# Altium schematic sheet acrostar_hv_boost.SchDoc: AcroIQ HV LED: Boost Controller
size A4; DocumentNumber: 2; Revision: C; SheetNumber: 2; SheetTotal: 4
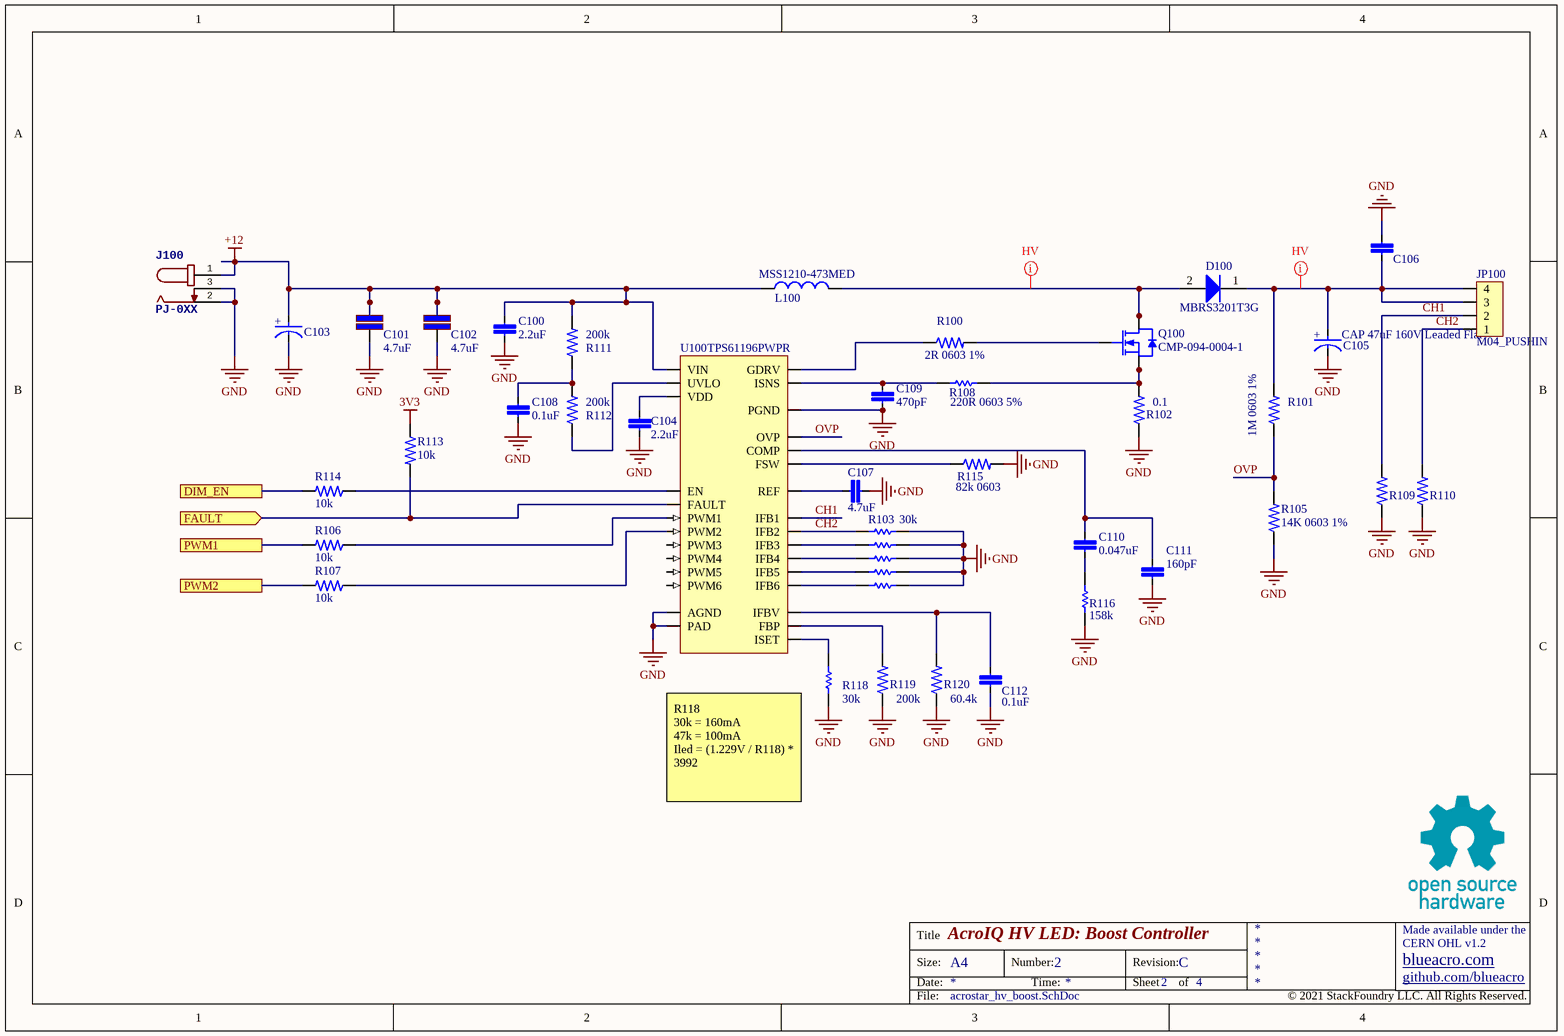
[diagram p0: acrostar_hv_boost.SchDoc]

## Parts
C100  2.2uF  [FP-CL10-IPC_B]
C101  4.7uF  [CAPC3225X20N]
C102  4.7uF  [CAPC3225X20N]
C103  CAP 100uF 25V POLY  [25SVF100M-Footprint-1]  (value not drawn)
C104  2.2uF  [FP-CL10-IPC_B]
C105  CAP 47uF 160V Leaded Flat  [CAP 47uF 160V Leaded Flat-Footprint-1]
C106  1uF 250V X7R 2220  [CAPC5750X23N]  (value not drawn)
C107  4.7uF  [FP-CL10-IPC_C]
C108  0.1uF  [FP-CL10-IPC_B]
C109  470pF  [FP-CL10-IPC_A]
C110  0.047uF  [FP-CL10-IPC_A]
C111  160pF  [FP-CL10-IPC_A]
C112  0.1uF  [FP-CL10-IPC_B]
D100  MBRS3201T3G  [ONSC-SMC-2-403-03_V]
J100  PJ-0XX  [PJ-036AH]
JP100  M04_PUSHIN  [PHOENIX_PTSM_4_1778780]
L100  MSS1210-473MED  [MSS1210-473MED-Footprint-1]
Q100  CMP-094-0004-1  [PG-TDSON-8]
R100  2R 0603 1%  [RESC1608-IPC-NL]
R101  1M 0603 1%  [RESC1608-IPC-NL]
R102  0.1  [RESC3016X07N]
R103  30k  [RESC1608-IPC-NL]
R104  30k  [RESC1608-IPC-NL]  (value not drawn)
R105  14K 0603 1%  [RESC1608-IPC-NL]
R106  10k  [RESC1608-IPC-NL]
R107  10k  [RESC1608-IPC-NL]
R108  220R 0603 5%  [RESC1608-IPC-NL]
R109  10M 0603  [RESC1608-IPC-NL]  (value not drawn)
R110  10M 0603  [RESC1608-IPC-NL]  (value not drawn)
R111  200k  [RESC1608-IPC-NL]
R112  200k  [RESC1608-IPC-NL]
R113  10k  [RESC1608-IPC-NL]
R114  10k  [RESC1608-IPC-NL]
R115  82k 0603  [RESC1608-IPC-LL]
R116  158k  [RESC1608-IPC-ML]
R118  30k  [RESC1608-IPC-NL]
R119  200k  [RESC1608-IPC-NL]
R120  60.4k  [RESC1608-IPC-NL]
R121  30k  [RESC1608-IPC-NL]  (value not drawn)
R122  30k  [RESC1608-IPC-NL]  (value not drawn)
R123  30k  [RESC1608-IPC-NL]  (value not drawn)
U100  TPS61196PWPR  [TSOP65P640X120_HS-29N]

## Ports
DIM_EN, FAULT (in), PWM1, PWM2

## Nets
3V3: R113.1
+12: C100.2 C101.2 C102.2 C103.2(A) J100.1 L100.1 R111.2 U100.28(VIN)
GND: C100.1 C101.1 C102.1 C103.1(C) C104.1 C105.1(C) C106.2 C107.2 C108.2 C109.2 C111.2 C112.2 J100.2 J100.3 R102.1 R103.1 R104.1 R105.1 R109.1 R110.1 R115.2 R116.1 R118.1 R119.1 R120.1 R121.1 R122.1 R123.1 U100.18(AGND) U100.22(PGND) U100.29(PAD)
CH1: JP100.2 R109.2 U100.12(IFB1)
CH2: JP100.1 R103.2 R110.2 U100.13(IFB2)
DIM_EN: R114.2 ; port DIM_EN
FAULT: R113.2 U100.27(FAULT) ; port FAULT
OVP: R101.1 R105.2 U100.19(OVP)
PWM1: R106.2 ; port PWM1
PWM2: R107.2 ; port PWM2
NetC104_2: C104.2 U100.25(VDD)
NetC105_2: C105.2(A) C106.1 D100.1(K) JP100.3 JP100.4 R101.2
NetC107_1: C107.1 U100.21(REF)
NetC108_1: C108.1 R111.1 R112.2
NetC109_1: C109.1 R108.1 U100.23(ISNS)
NetC110_1: C110.1 C111.1 U100.20(COMP)
NetC110_2: C110.2 R116.2
NetC112_1: C112.1 R120.2 U100.11(IFBV)
NetD100_2: D100.2(A) L100.2 Q100.5(D) Q100.6(D) Q100.7(D) Q100.8(D) Q100.PAD(D)
NetQ100_1: Q100.1(S) Q100.2(S) Q100.3(S) R102.2 R108.2
NetQ100_4: Q100.4(G) R100.2
NetR100_1: R100.1 U100.24(GDRV)
NetR104_2: R104.2 U100.14(IFB3)
NetR106_1: R106.1 U100.3(PWM1)
NetR107_1: R107.1 U100.4(PWM2)
NetR112_1: R112.1 U100.1(UVLO)
NetR114_1: R114.1 U100.2(EN)
NetR115_1: R115.1 U100.26(FSW)
NetR118_2: R118.2 U100.10(ISET)
NetR119_2: R119.2 U100.9(FBP)
NetR121_2: R121.2 U100.15(IFB4)
NetR122_2: R122.2 U100.16(IFB5)
NetR123_2: R123.2 U100.17(IFB6)

Not connected (* = marked no-connect by the designer): U100 5(PWM3) 6(PWM4) 7(PWM5) 8(PWM6)

## Layout directives
net class HV: NetC105_2, NetD100_2

## Notes on the sheet
- (near R118) R118
  30k = 160mA
  47k = 100mA
  Iled = (1.229V / R118) * 3992
- Title
- Size:
- Date:
- A4
- Number:
- Time:
- Revision:
- Sheet
- of
- github.com/blueacro
- blueacro.com
- CERN OHL v1.2
- Made available under the
- File:
- © 2021 StackFoundry LLC. All Rights Reserved.
- (in symbol CMP-001-00093-4) +
- (in symbol CMP-001-00100-1) +

## Library data of the parts
C100 C104 = CMP-001-00094-4: KEMET - C0603C225K4PACTU - CAP, MLCC, X5R, 2.2UF, 16V, 0603
C101 C102 = CMP-001-00083-2: CAP CER 4.7UF 50V X7R 1210; Tolerance: 10%; Material: Ceramic; Height: 1.8mm; Capacitance: 4.7uF; Contact Plating: Tin; Length: 3.2mm; Mount: Surface Mount; Dielectric: X7R; Case Code (Imperial): 1210; Min Operating Temperature: -55°C; Radiation Hardening: No; Lead Free: Lead Free; Max Operating Temperature: 125°C; Width: 0.098inch; Thickness: 0.079inch; Case/Package: 1210; Voltage Rating: 50V; Case Code (Metric): 3225; Voltage: 50V; Package Quantity: 1; Packaging: Tape and Reel; Depth: 2.5mm
C103 = CMP-001-00100-1: CAP ALUM POLY 100UF 20% 25V SMD
C105 = CMP-001-00093-4: Aluminum Electrolytic Capacitors - Leaded 47uF 160V 85c 12.5x20
C106 = CMP-001-00099-1: TDK         C5750X7R2E105K230KA             SMD Multilayer Ceramic Capacitor, 2220 [5750 Metric], 1 F, 250 V,  10%, X7R, C Series
C107 = CMP-001-00101-1: Cap Ceramic 4.7uF 6.3V X7R 10% SMD 0603 125°C Paper T/R
C108 C112 = CMP-001-00084-4: Cap Ceramic 0.1uF 50V X7R 20% SMD 0603 125C Paper T/R
C109 = CMP-001-00098-1: AVX - 06031C471KAT2A - SMD Multilayer Ceramic Capacitor, 470 pF, 100 V, 0603 [1608 Metric], ± 10%, X7R, AVX 0603 MLCC
C110 = CMP-001-00097-1: MURATA   GRM188R71E473KA01D   SMD Multilayer Ceramic Capacitor, GRM Series, 0.047 F,  10%, X7R, 25 V, 0603 [1608 Metric]
C111 = CMP-001-00096-1: CAP CER 160PF 50V C0G/NP0 0603
D100 = CMP-004-00036-1: ON SEMICONDUCTOR - MBRS3201T3G - Schottky Rectifier, 200 V, 3 A, Single, DO-214AB (SMC), 2 Pins, 840 mV
J100 = CMP-167-0003-1: Source: con-jack.SCHLIB; Design Item ID: PJ-0XX
JP100 = CMP-166-0035-1: Source: con-headers.SCHLIB; Design Item ID: M04_PUSHIN
L100 = CMP-006-00021-2: COILCRAFT   MSS1210-473MED   INDUCTOR, PWR, 47UH, 4.6A, 20%, 6MHZ
R100 = CMP-009-00190-3: RES SMD 2 OHM 1% 1/10W 0603
R101 = CMP-009-00187-4: VISHAY - CRCW06031M00FKEAHP - RES, AEC-Q200, THICK FILM, 1M, 0603
R102 = CMP-009-00196-1: Res Thick Film 1206 0.1 Ohm 1% 0.25W(1/4W) ±600ppm/C Molded SMD Paper T/R
R103 R104 R118 R121-R123 = CMP-009-00178-4: YAGEO - RC0603FR-0730KL - RES, THICK FILM, 30K, 1%, 0.1W, 0603, REEL; Temperature Coefficient: 100ppm/°C; Voltage Rating (DC): 50V; Power Rating: 100mW; Resistance: 30kR; Tolerance: 1%; Height: 0.45mm; Number of Pins: 2; Military Standard: Not; Lead Free: Lead Free; Max Operating Temperature: 155°C; Voltage Rating: 50V; Width: 0.8mm; Case Code (Imperial): 0603; Case Code (Metric): 1608; Case/Package: 0603; REACH SVHC: Unknown; Length: 1.6mm; Min Operating Temperature: -55°C; Resistor Type: Thick Film; Package Quantity: 5000; Packaging: Tape and Reel; Termination: SMD/SMT; Depth: 0.8mm
R105 = CMP-009-00194-1: Res Thick Film 0603 14K Ohm 1% 1/10W 100ppm/C Molded SMD SMD Punched Carrier T/R
R106 R107 R113 R114 = CMP-009-00191-3: Res General Purpose Thick Film 0603 10K Ohm 1% 1/10W ±100ppm/°C Molded SMD Paper T/R
R108 = CMP-009-00183-2: YAGEO - RC0603JR-07220RL - SMD Chip Resistor, 0603 [1608 Metric], 220 ohm, RC Series, 75 V, Thick Film, 100 mW; Working Voltage: 75V; Voltage Rating: 50V; Power Rating: 100mW; Temperature Coefficient: 100ppm/°C; REACH SVHC: No SVHC; Military Standard: Not; Resistance: 220R; Width: 0.8mm; Number of Terminations: 2; Termination: SMD/SMT; Resistor Type: Thick Film; Case/Package: 0603; Packaging: Tape and Reel; Tolerance: 5%; Number of Pins: 2; Case Code (Imperial): 0603; Voltage Rating (DC): 50V; Case Code (Metric): 1608; Length: 1.6mm; Max Operating Temperature: 155°C; Lead Free: Lead Free; Depth: 0.8mm; Min Operating Temperature: -55°C
R109 R110 = CMP-009-00197-1: Res Thick Film 0603 10M Ohm 5% 1/10W ±100ppm/°C Molded SMD SMD Paper T/R
R111 R112 R119 = CMP-009-00195-1: Thick Film Resistors - SMD 200K OHM 5%
R115 = CMP-009-00201-1: RES SMD 82K OHM 1% 1/10W 0603
R116 = CMP-009-00177-5: Res Thick Film 0603 158K Ohm 1% 0.1W(1/10W) ±100ppm/°C Pad SMD T/R; Power Rating: 100mW; Voltage Rating (DC): 50V; Resistance: 158kR; Working Voltage: 75V; Number of Terminations: 2; Depth: 0.8mm; Case/Package: 0603; Packaging: Tape and Reel; Length: 1.6mm; Voltage Rating: 50V; Military Standard: Not; Min Operating Temperature: -55°C; Height: 0.45mm; Max Operating Temperature: 155°C; Case Code (Metric): 1608; Lead Free: Lead Free; Tolerance: 1%; Width: 0.8mm; Case Code (Imperial): 0603; Resistor Type: Thick Film; Temperature Coefficient: 100ppm/°C; Termination: SMD/SMT; Package Quantity: 5000
R120 = CMP-009-00198-1: Res Thick Film 0603 60.4K Ohm 1% 0.1W(1/10W) ±100ppm/C Epoxy SMD T/R
U100 = CMP-019-00056-4: LED DRVR 9V/12V/15V/18V/24V 28-Pin HTSSOP EP T/R
Q100 = CMP-094-0004-1: Source: fet.SchLib; Design Item ID: NFET_3S_5D